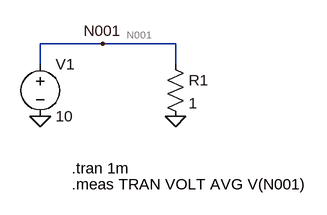
[diagram p0: schematic circuit.asc]
circuit.asc, the LTspice schematic file:
Version 4
SHEET 1 880 680
WIRE 288 176 192 176
WIRE 400 176 288 176
WIRE 192 208 192 176
WIRE 400 208 400 176
FLAG 400 288 0
FLAG 192 288 0
FLAG 288 176 N001
SYMBOL voltage 192 192 R0
SYMATTR InstName V1
SYMATTR Value 10
SYMBOL Res 384 192 R0
SYMATTR InstName R1
SYMATTR Value 1
TEXT 240 368 Left 2 !.tran 1m
TEXT 240 392 Left 2 !.meas TRAN VOLT AVG V(N001)

The netlist it stands for:
* circuit.asc
V1 N001 0 10
R1 N001 0 1
.tran 1m
.meas TRAN VOLT AVG V(N001)
.backanno
.end